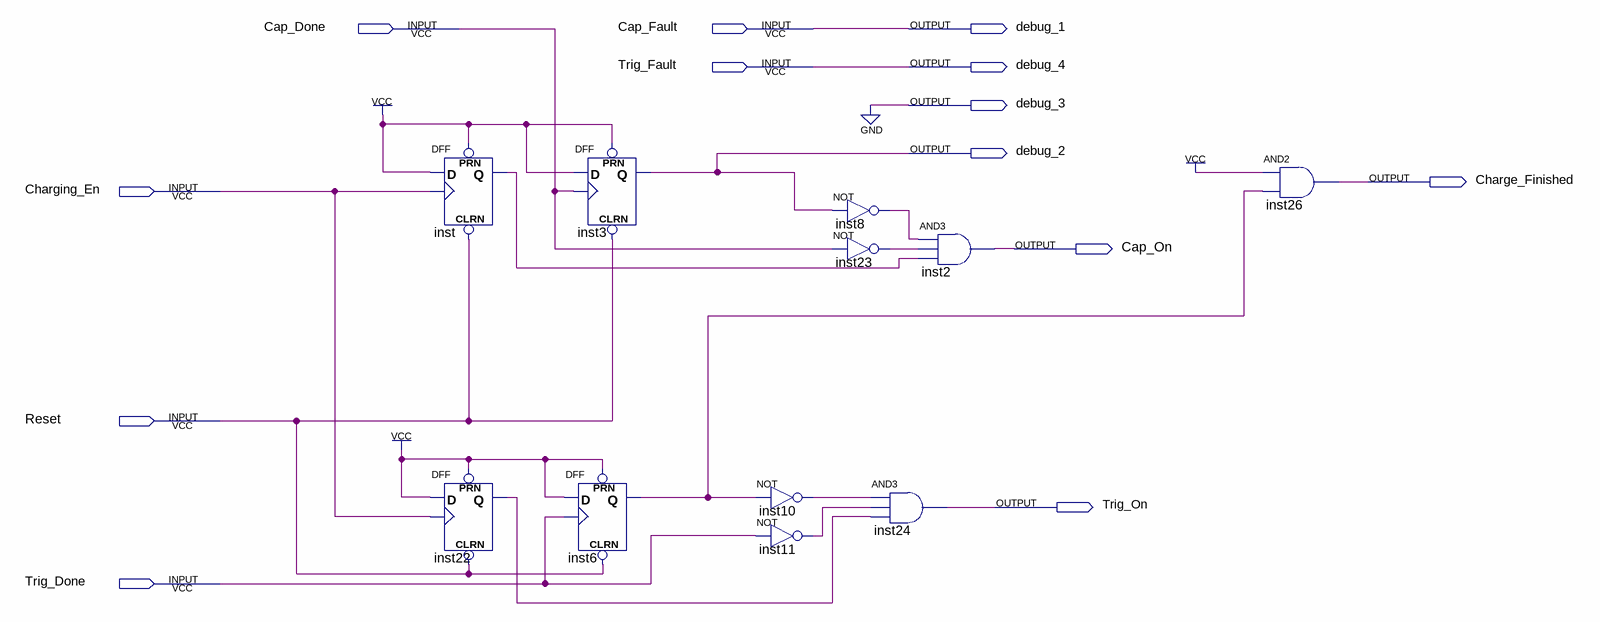
[diagram p0: schematic sheet]
// Quartus schematic Charging.bdf as structural Verilog: 11 symbols, 13 pins
module Charging (
  input  Cap_Done,
  input  Cap_Fault,
  input  Trig_Fault,
  input  Charging_En,
  input  Reset,
  input  Trig_Done,
  output debug_1,
  output debug_4,
  output debug_3,
  output debug_2,
  output Charge_Finished,
  output Cap_On,
  output Trig_On
);

  wire inst6_q, inst8_out, inst10_out, inst11_out, inst22_q, inst23_out, inst_q;

  DFF inst (.CLRN(Reset), .CLK(Charging_En), .D(1'b1), .PRN(1'b1), .Q(inst_q));
  DFF inst22 (.CLRN(Reset), .CLK(Charging_En), .D(1'b1), .PRN(1'b1), .Q(inst22_q));
  DFF inst3 (.CLRN(Reset), .CLK(Cap_Done), .D(1'b1), .PRN(1'b1), .Q(debug_2));
  DFF inst6 (.CLRN(Reset), .CLK(Trig_Done), .D(1'b1), .PRN(1'b1), .Q(inst6_q));
  not inst10 (inst10_out, inst6_q);
  not inst11 (inst11_out, Trig_Done);
  not inst8 (inst8_out, debug_2);
  not inst23 (inst23_out, Cap_Done);
  and inst24 (Trig_On, inst10_out, inst11_out, inst22_q);
  and inst2 (Cap_On, inst8_out, inst23_out, inst_q);
  and inst26 (Charge_Finished, 1'b1, inst6_q);

  assign debug_1 = Cap_Fault;
  assign debug_3 = 1'b0;
  assign debug_4 = Trig_Fault;
endmodule
